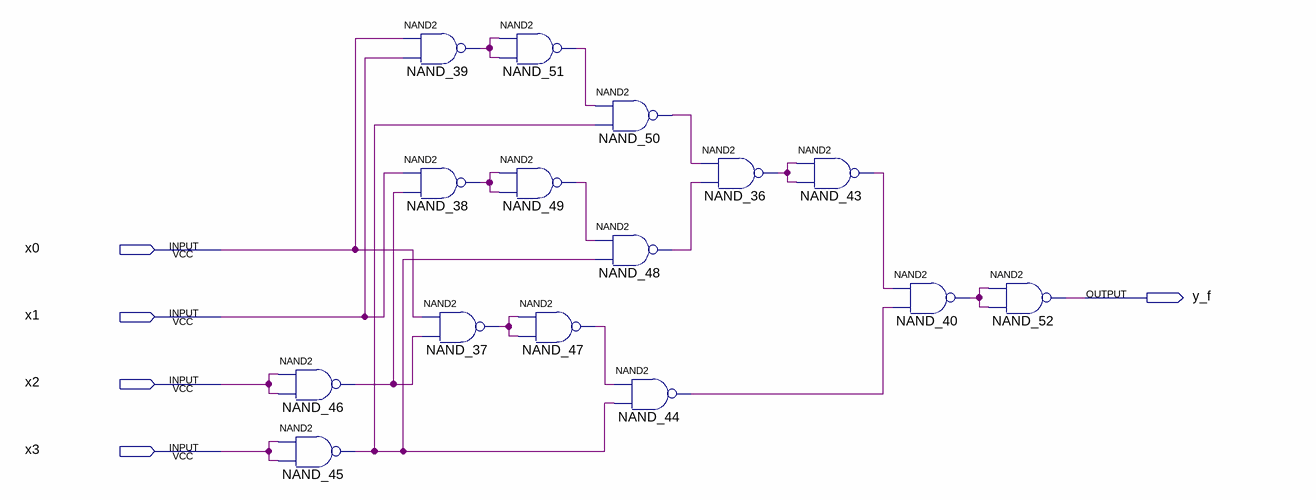
[diagram p0: schematic sheet]
// Quartus schematic f_schema.bdf as structural Verilog: 15 symbols, 5 pins
module f_schema (
  input  x0,
  input  x1,
  input  x2,
  input  x3,
  output y_f
);

  wire NAND_36_out, NAND_37_out, NAND_38_out, NAND_39_out, NAND_40_out, NAND_43_out, NAND_44_out,
       NAND_45_out, NAND_46_out, NAND_47_out, NAND_48_out, NAND_49_out, NAND_50_out, NAND_51_out;

  nand NAND_46 (NAND_46_out, x2, x2);
  nand NAND_45 (NAND_45_out, x3, x3);
  nand NAND_39 (NAND_39_out, x0, x1);
  nand NAND_38 (NAND_38_out, x1, NAND_46_out);
  nand NAND_37 (NAND_37_out, x0, NAND_46_out);
  nand NAND_51 (NAND_51_out, NAND_39_out, NAND_39_out);
  nand NAND_49 (NAND_49_out, NAND_38_out, NAND_38_out);
  nand NAND_47 (NAND_47_out, NAND_37_out, NAND_37_out);
  nand NAND_50 (NAND_50_out, NAND_51_out, NAND_45_out);
  nand NAND_48 (NAND_48_out, NAND_49_out, NAND_45_out);
  nand NAND_44 (NAND_44_out, NAND_47_out, NAND_45_out);
  nand NAND_36 (NAND_36_out, NAND_50_out, NAND_48_out);
  nand NAND_43 (NAND_43_out, NAND_36_out, NAND_36_out);
  nand NAND_40 (NAND_40_out, NAND_43_out, NAND_44_out);
  nand NAND_52 (y_f, NAND_40_out, NAND_40_out);
endmodule
